# EAGLE design AirU_v2.0_wADC (EAGLE 8.5.0)
COMPANY: ADAFRUIT INDUSTRIES; DRAWN: KTOWN; REV: B

## Sheet 1 of 2
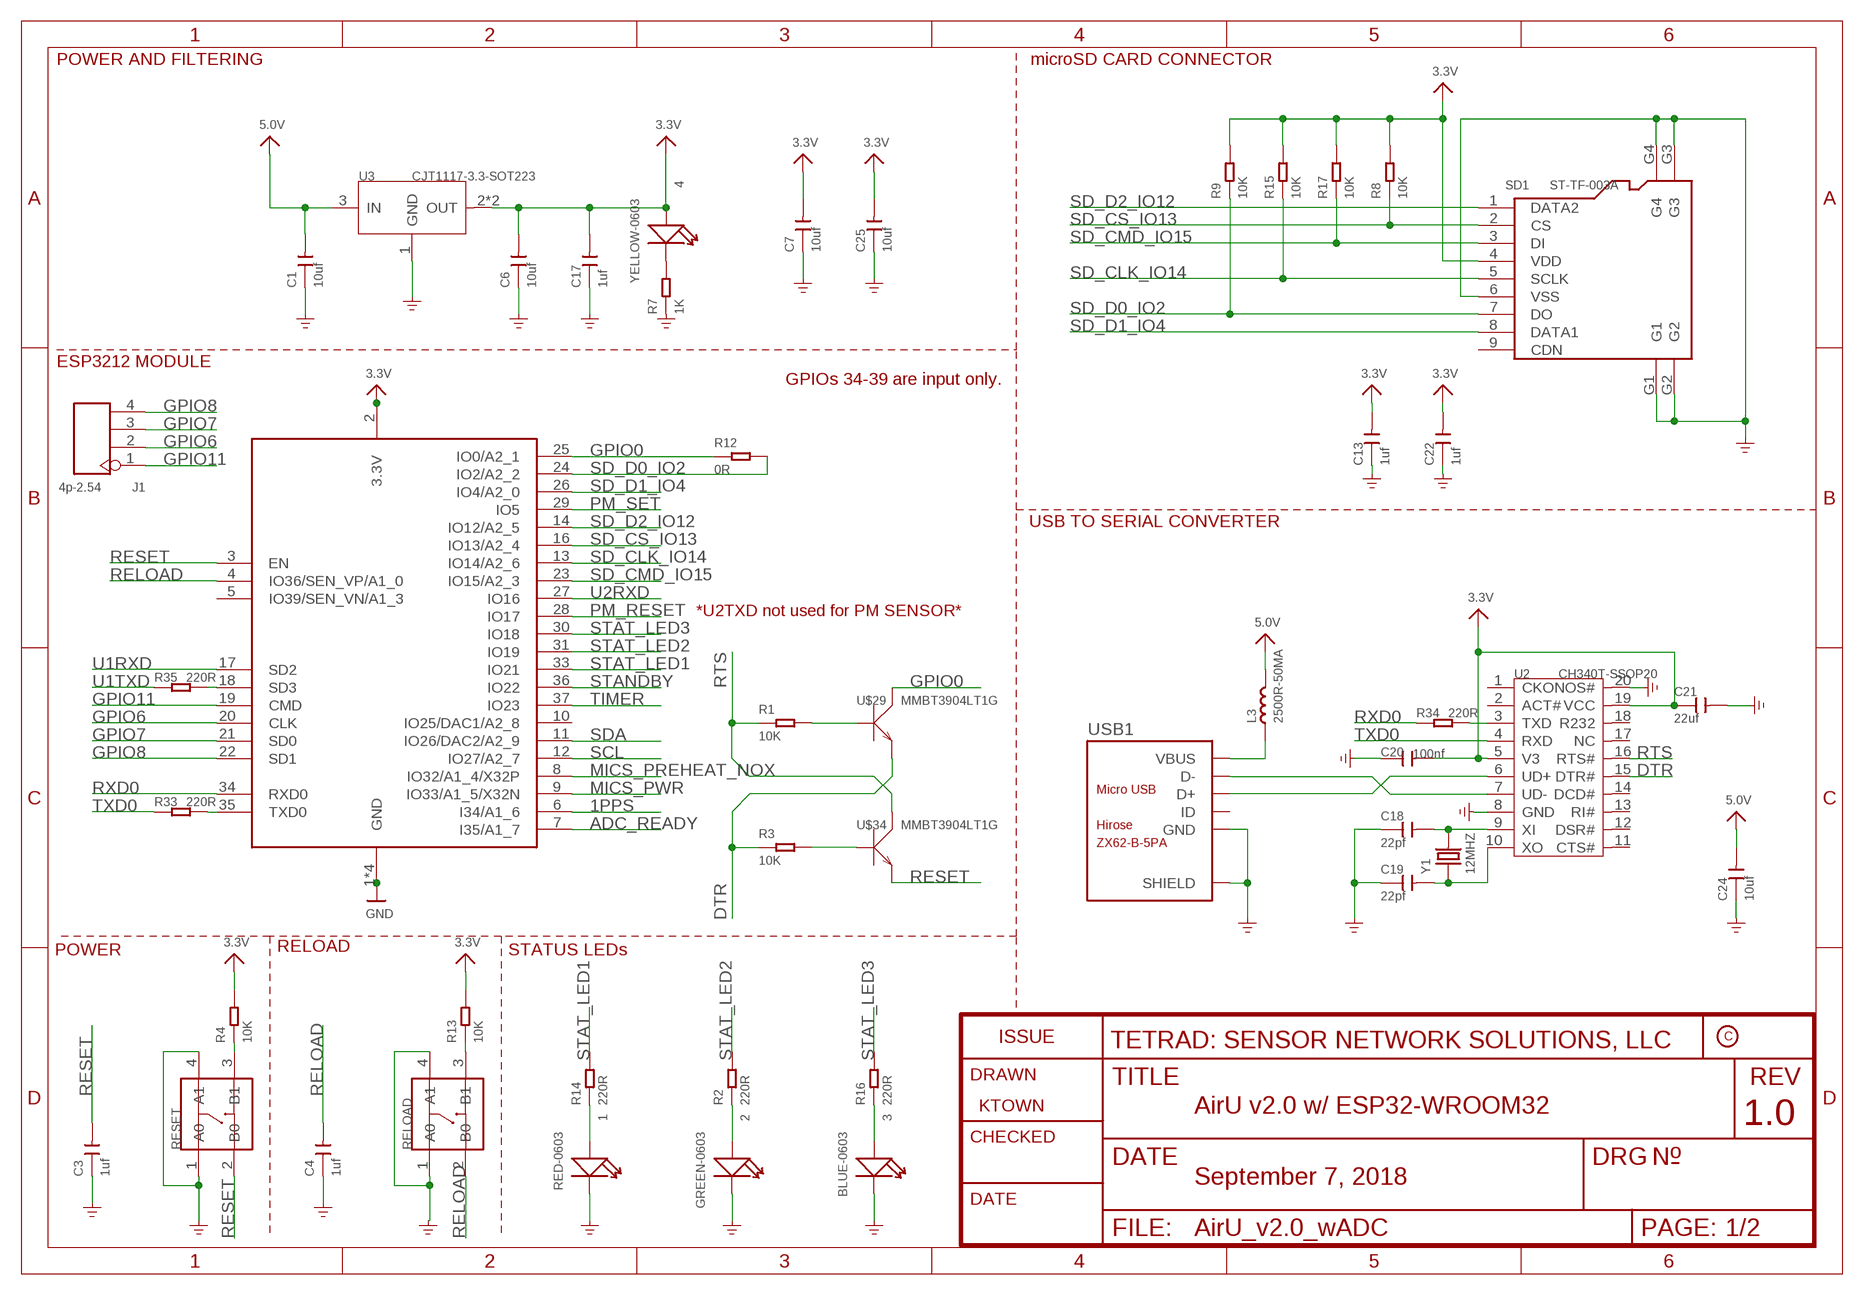
[diagram p0: schematic, sheet 1]
FRAME1 (FRAME_A4): COMPANY: TETRAD: SENSOR NETWORK SOLUTIONS, LLC; REV: 1.0

### Parts
1  RED-0603  LED-SMD-RED-DIFFUSED(0603)  [LED-0603]
2  GREEN-0603  SMD-LED-CLEAR-GREEN(0603)  [LED-0603]
3  BLUE-0603  SMD-LED-CLEAR-BLUE(0603)  [LED-0603]
4  YELLOW-0603  SMD-LED-CLEAR-YELLOW(0603)  [LED-0603]
C1  10uf  CERAMIC-10UF-10V-10%-X5R(0603)  [C0603]
C3  1uf  CERAMIC-1UF-25V-10%-X7R(0603)  [C0603]
C4  1uf  CERAMIC-1UF-25V-10%-X7R(0603)  [C0603]
C6  10uf  CERAMIC-10UF-10V-10%-X5R(0603)  [C0603]
C7  10uf  CERAMIC-10UF-10V-10%-X5R(0603)  [C0603]
C13  1uf  CERAMIC-1UF-25V-10%-X7R(0603)  [C0603]
C17  1uf  CERAMIC-1UF-25V-10%-X7R(0603)  [C0603]
C18  22pf  CERAMIC-22PF-50V-5%-NPO(0603)  [C0603]
C19  22pf  CERAMIC-22PF-50V-5%-NPO(0603)  [C0603]
C20  100nf  CERAMIC-100NF-50V-10%-X7R(0603)  [C0603]
C21  22uf  CERAMIC-22UF-6.3V-20%-X5R(0805)  [C0805]
C22  1uf  CERAMIC-1UF-25V-10%-X7R(0603)  [C0603]
C24  10uf  CERAMIC-10UF-10V-10%-X5R(0603)  [C0603]
C25  10uf  CERAMIC-10UF-10V-10%-X5R(0603)  [C0603]
J1  4p-2.54  DIP-BLACK-MALE-HEADER-VERT(4P-2.54)  [H4-2.54]
L3  2500R-50MA  SMD-FERRITE-BEAD-2500R-50MA(0603)  [L0603]
R1  10K  SMD-RES-10K-1%-1/10W(0603)  [R0603]
R2  220R  SMD-RES-220R-5%-1/10W(0603)  [R0603]
R3  10K  SMD-RES-10K-1%-1/10W(0603)  [R0603]
R4  10K  SMD-RES-10K-1%-1/10W(0603)  [R0603]
R7  1K  SMD-RES-1K-1%-1/10W(0603)  [R0603]
R8  10K  SMD-RES-10K-1%-1/10W(0603)  [R0603]
R9  10K  SMD-RES-10K-1%-1/10W(0603)  [R0603]
R12  0R  SMD-RES-0R-5%-1/10W(0603)  [R0603]
R13  10K  SMD-RES-10K-1%-1/10W(0603)  [R0603]
R14  220R  SMD-RES-220R-5%-1/10W(0603)  [R0603]
R15  10K  SMD-RES-10K-1%-1/10W(0603)  [R0603]
R16  220R  SMD-RES-220R-5%-1/10W(0603)  [R0603]
R17  10K  SMD-RES-10K-1%-1/10W(0603)  [R0603]
R33  220R  SMD-RES-220R-5%-1/10W(0603)  [R0603]
R34  220R  SMD-RES-220R-5%-1/10W(0603)  [R0603]
R35  220R  SMD-RES-220R-5%-1/10W(0603)  [R0603]
RELOAD  DIP-SWITCH-TACTILE-SPST-NO/TS-1109(4P-D6.0MM)'TS-1109'  [SW4-6.0X6.0X5.0MM]
RESET  DIP-SWITCH-TACTILE-SPST-NO/TS-1109(4P-D6.0MM)'TS-1109'  [SW4-6.0X6.0X5.0MM]
SD1  ST-TF-003A  MICRO-SD-CARD-SOCKET-9P(ST-TF-003A)  [MICRO-SD9+4P-SMD-16.1X14.5X1.85MM]
U2  CH340T-SSOP20  INTERFACE-CH340T(SSOP20)  [SSOP20-0.65-7.6X5.2MM]
U3  CJT1117-3.3-SOT223  PMIC-CJT1117-3.3(SOT223)  [SOT-223]
U$29  MMBT3904LT1G  SMD-TRANSISTORS-NPN-40V-200MA-MMBT3904LT1G(SOT-23)  [SOT-23]
U$34  MMBT3904LT1G  SMD-TRANSISTORS-NPN-40V-200MA-MMBT3904LT1G(SOT-23)  [SOT-23]
USB1  ZX62-B-5PA  MICRO-USB-SMD(ZX62-B-5PA)  [MICRO-USB5+6P-SMD-0.65-AB]
X2  ESP32_WROOM32_SKINNY  [WROOM32_SKINNY]
Y1  12MHZ  SMD-CRYSTAL-12MHZ-20PF-20PPM-40R(2P-5.0X3.2MM)  [X2-SMD-5.0X3.2X1.3MM]

### Nets
1PPS: X2.6(I34/A1_6) ; also sheet 2
3.3V: 4.+ C6.2 C7.2 C13.2 C17.2 C20.2 C21.1 C22.2 C25.2 R4.2 R8.2 R9.2 R13.2 R15.2 R17.2 SD1.4(VDD) U2.5(V3) U2.19(VCC) U3.2(OUT) U3.TER(OUT) X2.2(3.3V) ; also sheet 2
5.0V: C1.2 C24.2 L3.2 U3.3(IN) ; also sheet 2
ADC_READY: X2.7(I35/A1_7) ; also sheet 2
DTR: R3.1 U2.15(DTR#) U$29.2(E)
GND: 1.- 2.- 3.- C1.1 C3.1 C4.1 C6.1 C7.1 C13.1 C17.1 C18.1 C19.1 C20.1 C21.2 C22.1 C24.1 C25.1 R7.1 RELOAD.1(A0) RELOAD.4(A1) RESET.1(A0) RESET.4(A1) SD1.6(VSS) SD1.G1 SD1.G2 SD1.G3 SD1.G4 U2.8(GND) U2.20(NOS#) U3.1(GND) USB1.5(GND) USB1.P1(SHIELD) USB1.P2(SHIELD) USB1.P3_1(SHIELD) USB1.P3_2(SHIELD) USB1.P3_3(SHIELD) USB1.P4_1(SHIELD) USB1.P4_2(SHIELD) USB1.P4_3(SHIELD) USB1.P5(SHIELD) USB1.P6(SHIELD) X2.1(GND) X2.15(GND) X2.38(GND) X2.P$1(GND) ; supply symbol labelled GND_POWER ; also sheet 2
GPIO0: R12.1 U$29.3(C) X2.25(IO0/A2_1)
GPIO6: J1.2 X2.20(CLK)
GPIO7: J1.3 X2.21(SD0)
GPIO8: J1.4 X2.22(SD1)
GPIO11: J1.1 X2.19(CMD)
MICS_PREHEAT_NOX: X2.8(IO32/A1_4/X32P) ; also sheet 2
MICS_PWR: X2.9(IO33/A1_5/X32N) ; also sheet 2
N$1: 2.+ R2.1
N$7: 1.+ R14.1
N$12: R3.2 U$34.1(B)
N$13: R1.2 U$29.1(B)
N$22: 3.+ R16.1
N$25: 4.- R7.2
N$26: U2.7(UD-) USB1.2(D-)
N$27: U2.6(UD+) USB1.3(D+)
N$28: C18.2 U2.9(XI) Y1.2
N$29: C19.2 U2.10(XO) Y1.1
N$30: R34.2 U2.3(TXD)
N$31: R35.2 X2.18(SD3)
N$33: R33.2 X2.35(TXD0)
N$37: R13.1 RELOAD.3(B1)
N$38: R4.1 RESET.3(B1)
PM_RESET: X2.28(IO17) ; also sheet 2
PM_SET: X2.29(IO5) ; also sheet 2
RELOAD: C4.2 RELOAD.2(B0) X2.4(IO36/SEN_VP/A1_0)
RESET: C3.2 RESET.2(B0) U$34.2(E) X2.3(EN)
RTS: R1.1 U2.16(RTS#) U$34.3(C)
RXD0: R34.1 X2.34(RXD0)
SCL: X2.12(IO27/A2_7) ; also sheet 2
SD_CLK_IO14: R15.1 SD1.5(SCLK) X2.13(IO14/A2_6)
SD_CMD_IO15: R17.1 SD1.3(DI) X2.23(IO15/A2_3)
SD_CS_IO13: R8.1 SD1.2(CS) X2.16(IO13/A2_4)
SD_D0_IO2: R9.1 R12.2 SD1.7(DO) X2.24(IO2/A2_2)
SD_D1_IO4: SD1.8(DATA1) X2.26(IO4/A2_0)
SD_D2_IO12: SD1.1(DATA2) X2.14(IO12/A2_5)
SDA: X2.11(IO26/DAC2/A2_9) ; also sheet 2
STANDBY: X2.36(IO22) ; also sheet 2
STAT_LED1: R14.2 X2.33(IO21)
STAT_LED2: R2.2 X2.31(IO19)
STAT_LED3: R16.2 X2.30(IO18)
TIMER: X2.37(IO23) ; also sheet 2
TXD0: R33.1 U2.4(RXD)
U1RXD: X2.17(SD2) ; also sheet 2
U1TXD: R35.1 ; also sheet 2
U2RXD: X2.27(IO16) ; also sheet 2
VBUS: L3.1 USB1.1(VBUS)
Unconnected: SD1.9(CDN) U2.1(CKO) U2.2(ACT#) U2.11(CTS#) U2.12(DSR#) U2.13(RI#) U2.14(DCD#) U2.17(NC) U2.18(R232) USB1.4(ID) X2.5(IO39/SEN_VN/A1_3) X2.10(IO25/DAC1/A2_8)

### Notes on the sheet
- POWER AND FILTERING | microSD CARD CONNECTOR
- ESP3212 MODULE
- GPIOs 34-39 are input only.
- USB TO SERIAL CONVERTER
- *U2TXD not used for PM SENSOR*
- POWER | RELOAD | STATUS LEDs
- AirU v2.0 w/ ESP32-WROOM32
- September 7, 2018

## Sheet 2 of 2
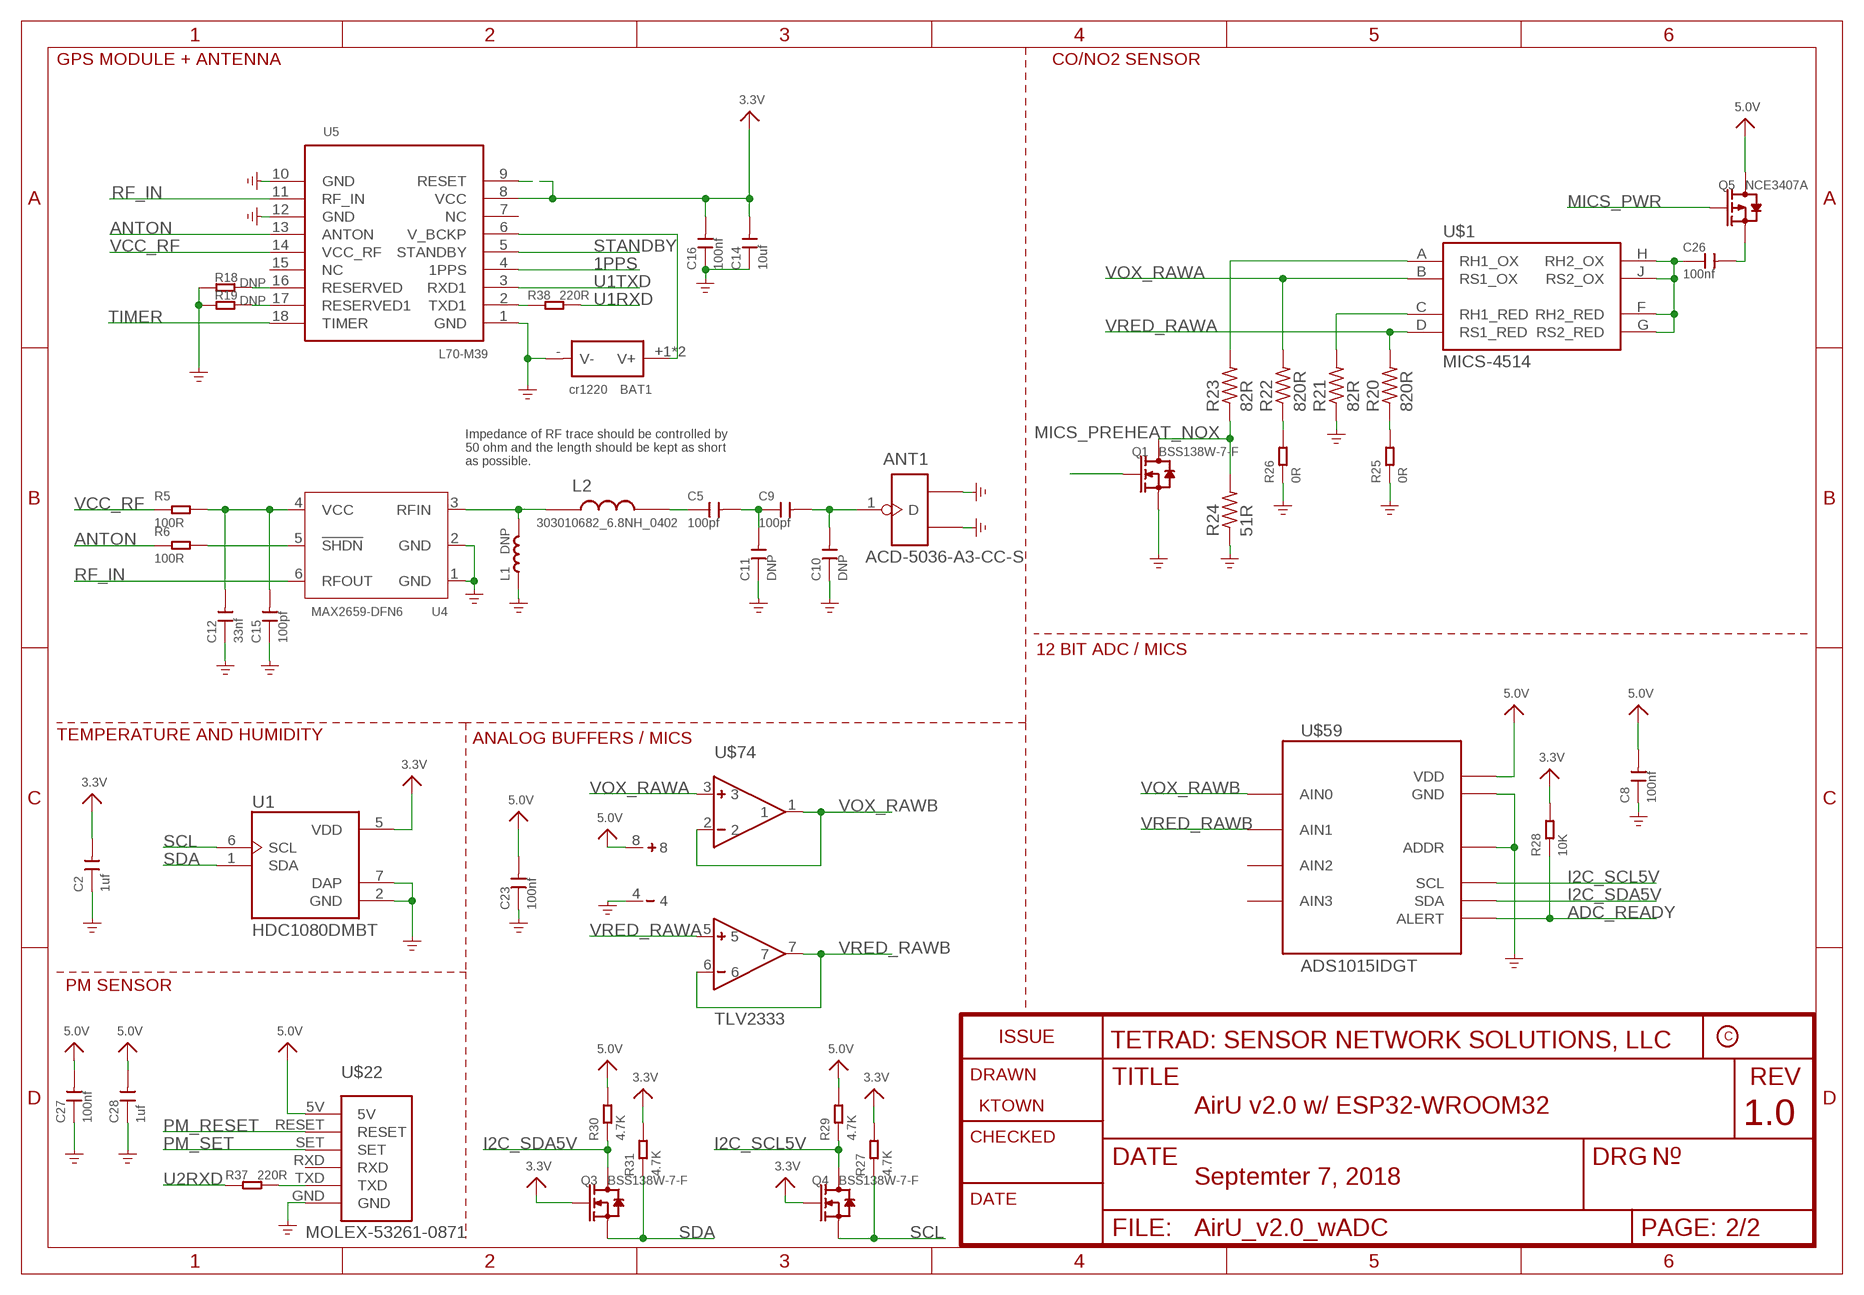
[diagram p1: schematic, sheet 2]
FRAME2 (FRAME_A4): COMPANY: TETRAD: SENSOR NETWORK SOLUTIONS, LLC; REV: 1.0
FRAME3 (FRAME_A4): COMPANY: TETRAD: SENSOR NETWORK SOLUTIONS, LLC; REV: 1.0

### Parts
ANT1  ACD-5036-A3-CC-S  ANTENNA-ACD5036  [ANT3-SMD-5.2X3.7X0.7MM]
BAT1  cr1220  DIP-BATTERY-CELL-HOLDER(1220)  [BAT2P-13.5-CR1220]
C2  1uf  CERAMIC-1UF-25V-10%-X7R(0603)  [C0603]
C5  100pf  CERAMIC-100PF-50V-5%-NPO(0603)  [C0603]
C8  100nf  CERAMIC-100NF-50V-10%-X7R(0603)  [C0603]
C9  100pf  CERAMIC-100PF-50V-5%-NPO(0603)  [C0603]
C10  DNP  CERAMIC-100PF-50V-5%-NPO(0603)  [C0603]
C11  DNP  CERAMIC-100PF-50V-5%-NPO(0603)  [C0603]
C12  33nf  CERAMIC-33NF-50V-10%-X7R(0603)  [C0603]
C14  10uf  CERAMIC-10UF-10V-10%-X5R(0603)  [C0603]
C15  100pf  CERAMIC-100PF-50V-5%-NPO(0603)  [C0603]
C16  100nf  CERAMIC-100NF-50V-10%-X7R(0603)  [C0603]
C23  100nf  CERAMIC-100NF-50V-10%-X7R(0603)  [C0603]
C26  100nf  CERAMIC-100NF-50V-10%-X7R(0603)  [C0603]
C27  100nf  CERAMIC-100NF-50V-10%-X7R(0603)  [C0603]
C28  1uf  CERAMIC-1UF-25V-10%-X7R(0603)  [C0603]
L1  DNP  INDUCTOR/FERRITE-BEAD-0201  [L0201]
L2  303010682_6.8NH_0402  [L0402]
Q1  BSS138W-7-F  SMD-MOSFET-N-CH-50V-200MA-BSS138W-7-F(SOT-23)  [SOT-23]
Q3  BSS138W-7-F  SMD-MOSFET-N-CH-50V-200MA-BSS138W-7-F(SOT-23)  [SOT-23]
Q4  BSS138W-7-F  SMD-MOSFET-N-CH-50V-200MA-BSS138W-7-F(SOT-23)  [SOT-23]
Q5  NCE3407A  SMD-MOSFET-P-CH-VDC=30V-ID=4.3A-NCE3407A(SOT-23)  [SOT-23]
R5  100R  SMD-RES-100R-5%-1/10W(0603)  [R0603]
R6  100R  SMD-RES-100R-5%-1/10W(0603)  [R0603]
R18  DNP  SMD-RES-10K-1%-1/10W(0603)  [R0603]
R19  DNP  SMD-RES-10K-1%-1/10W(0603)  [R0603]
R20  820R  R-US_R0805  [R0805]
R21  82R  R-US_R0603  [R0603]
R22  820R  R-US_R0805  [R0805]
R23  82R  R-US_R0603  [R0603]
R24  51R  R-US_R0603  [R0603]
R25  0R  SMD-RES-0R-5%-1/10W(0603)  [R0603]
R26  0R  SMD-RES-0R-5%-1/10W(0603)  [R0603]
R27  4.7K  SMD-RES-4.7K-5%-1/10W(0603)  [R0603]
R28  10K  SMD-RES-10K-1%-1/10W(0603)  [R0603]
R29  4.7K  SMD-RES-4.7K-5%-1/10W(0603)  [R0603]
R30  4.7K  SMD-RES-4.7K-5%-1/10W(0603)  [R0603]
R31  4.7K  SMD-RES-4.7K-5%-1/10W(0603)  [R0603]
R37  220R  SMD-RES-220R-5%-1/10W(0603)  [R0603]
R38  220R  SMD-RES-220R-5%-1/10W(0603)  [R0603]
U1  HDC1080DMBT  [SON100P300X300X80-7N]
U4  MAX2659-DFN6  AMPLIFIER-MAX2659  [DFN6-0.5-1.5X1.2X0.72MM]
U5  L70-M39  MOUDLE-GPS-L70-HARDWARE  [LGA18-1.1-9.7X10.1X2.5MM]
U$1  MICS-4514  [MICS_10-SMD]
U$22  MOLEX-53261-0871  [MOLEX-53261-0871]
U$59  ADS1015IDGT  [MSOP10_0.5]
U$74  TLV2333  [TLV2333]

### Nets
1PPS: U5.4(1PPS) ; also sheet 1
3.3V: C2.2 C14.2 C16.2 Q3.1(G) Q4.1(G) R27.2 R28.2 R31.2 U1.5(VDD) U5.8(VCC) U5.9(RESET) ; also sheet 1
5.0V: C8.2 C23.2 C27.2 C28.2 Q5.3(D) R29.2 R30.2 U$22.5V U$59.8(VDD) U$74.8 ; also sheet 1
ADC_READY: R28.1 U$59.2(ALERT) ; also sheet 1
ANTON: R6.1 U5.13(ANTON)
GND: ANT1.2(GND1) ANT1.3(GND2) BAT1.-(V-) C2.1 C8.1 C10.1 C11.1 C12.1 C14.1 C15.1 C16.1 C23.1 C27.1 C28.1 L1.1 Q1.2(S) R18.1 R19.1 R21.1 R24.1 R25.1 R26.1 U1.2(GND) U1.7(DAP) U4.1(GND) U4.2(GND) U5.1(GND) U5.10(GND) U5.12(GND) U$22.GND U$59.1(ADDR) U$59.3(GND) U$74.4 ; supply symbol labelled GND_POWER ; also sheet 1
I2C_SCL5V: Q4.3(D) R29.1 U$59.10(SCL)
I2C_SDA5V: Q3.3(D) R30.1 U$59.9(SDA)
MICS_PREHEAT_NOX: Q1.1(G) ; also sheet 1
MICS_PWR: Q5.1(G) ; also sheet 1
N$2: R21.2 U$1.C(RH1_RED)
N$3: C5.2 C9.1 C11.2
N$4: ANT1.1(D) C9.2 C10.2
N$5: L1.2 L2.P$1 U4.3(RFIN)
N$6: R23.2 U$1.A(RH1_OX)
N$8: C5.1 L2.P$2
N$9: R6.2 U4.5(!SHDN)
N$10: C12.2 C15.2 R5.2 U4.4(VCC)
N$11: R18.2 U5.16(RESERVED)
N$14: R19.2 U5.17(RESERVED1)
N$15: BAT1.+1(V+) BAT1.+2(V+) U5.6(V_BCKP)
N$17: R38.1 U5.2(TXD1)
N$18: C26.2 Q5.2(S)
N$23: Q1.3(D) R23.1 R24.2
N$24: C26.1 U$1.F(RH2_RED) U$1.G(RS2_RED) U$1.H(RH2_OX) U$1.J(RS2_OX)
N$32: R22.1 R26.2
N$34: R20.1 R25.2
N$36: R37.2 U$22.TXD
PM_RESET: U$22.RESET ; also sheet 1
PM_SET: U$22.SET ; also sheet 1
RF_IN: U4.6(RFOUT) U5.11(RF_IN)
SCL: Q4.2(S) R27.1 U1.6(SCL) ; also sheet 1
SDA: Q3.2(S) R31.1 U1.1(SDA) ; also sheet 1
STANDBY: U5.5(STANDBY) ; also sheet 1
TIMER: U5.18(TIMER) ; also sheet 1
U1RXD: R38.2 ; also sheet 1
U1TXD: U5.3(RXD1) ; also sheet 1
U2RXD: R37.1 ; also sheet 1
VCC_RF: R5.1 U5.14(VCC_RF)
VOX_RAWA: R22.2 U$1.B(RS1_OX) U$74.3
VOX_RAWB: U$59.4(AIN0) U$74.1 U$74.2
VRED_RAWA: R20.2 U$1.D(RS1_RED) U$74.5
VRED_RAWB: U$59.5(AIN1) U$74.6 U$74.7
Unconnected: U5.7(NC) U5.15(NC) U$22.RXD U$59.6(AIN2) U$59.7(AIN3)

### Notes on the sheet
- GPS MODULE + ANTENNA | CO/NO2 SENSOR
- Impedance of RF trace should be controlled by 
  50 ohm and the length should be kept as short 
  as possible.
- 12 BIT ADC / MICS
- TEMPERATURE AND HUMIDITY | ANALOG BUFFERS / MICS
- PM SENSOR
- AirU v2.0 w/ ESP32-WROOM32
- Septemter 7, 2018

## Library data of the parts
1 = Seeed-LED:LED-SMD-RED-DIFFUSED(0603): 304090042; MPN: 19-217-R6C-AL1M2VY-3T
2 = Seeed-LED:SMD-LED-CLEAR-GREEN(0603): 304090043; MPN: 19-217-G7C-AN1P2-3T
3 = Seeed-LED:SMD-LED-CLEAR-BLUE(0603): 304090045; MPN: 19-217-BHC-ZL1M2RY-3T
4 = Seeed-LED:SMD-LED-CLEAR-YELLOW(0603): 304090044; MPN: 19-217-Y5C-AM1N1VY-3T
ANT1 = Connector-new:ANTENNA-ACD5036; MPN: ACD-5036-A3-CC-S
BAT1 = Seeed-Connector:DIP-BATTERY-CELL-HOLDER(1220): 320170002
C1 C6 C7 C14 C24 C25 = Seeed-Capacitor:CERAMIC-10UF-10V-10%-X5R(0603): 302010103; MPN: CC0603KRX5R6BB106
C2-C4 C13 C17 C22 C28 = Seeed-Capacitor:CERAMIC-1UF-25V-10%-X7R(0603): 302010139; MPN: CC0603KRX7R8BB105
C5 C9 C15 = Seeed-Capacitor:CERAMIC-100PF-50V-5%-NPO(0603): 302010076; MPN: CC0603JRNPO9BN101
C8 C16 C20 C23 C26 C27 = Seeed-Capacitor:CERAMIC-100NF-50V-10%-X7R(0603): 302010138; MPN: CC0603KRX7R9BB104
C10 C11 = Seeed-Capacitor:CERAMIC-100PF-50V-5%-NPO(0603): 302010076; MPN: CC0603JRNPO9BN101; VALUE: 100pf
C12 = Seeed-Capacitor:CERAMIC-33NF-50V-10%-X7R(0603): 302010088; MPN: CC0603KRX7R9BB333
C18 C19 = Seeed-Capacitor:CERAMIC-22PF-50V-5%-NPO(0603): 302010143; MPN: CC0603JRNPO9BN220
C21 = Seeed-Capacitor:CERAMIC-22UF-6.3V-20%-X5R(0805): 302010171; MPN: CC0805MKX5R5BB226
J1 = Seeed-Connector:DIP-BLACK-MALE-HEADER-VERT(4P-2.54): 320020017; MPN: P125-1104A0BS116A1
L1 = Discrete-new:INDUCTOR/FERRITE-BEAD
L2 = Seeed-OPL-2017-01-Inductor-Akita:303010682_6.8NH_0402: Murata;LQW15AN6N8G00D, SMD Inductor 6.8nH-2%-700mA;0402, SKU: 303010682
L3 = Seeed-Inductor:SMD-FERRITE-BEAD-2500R-50MA(0603): 303030020
Q1 Q3 Q4 = Seeed-Transistor:SMD-MOSFET-N-CH-50V-200MA-BSS138W-7-F(SOT-23): 305030000; MPN: BSS138W-7-F
Q5 = Seeed-Transistor:SMD-MOSFET-P-CH-VDC=30V-ID=4.3A-NCE3407A(SOT-23): 305030010; MPN: NCE3407A
R1 R3 R4 R8 R9 R13 R15 R17 R28 = Seeed-Resistor:SMD-RES-10K-1%-1/10W(0603): 301010299; MPN: RC0603FR-0710KL
R2 R14 R16 R33-R35 R37 R38 = Seeed-Resistor:SMD-RES-220R-5%-1/10W(0603): 301010163; MPN: RC0603JR-07220RL
R5 R6 = Seeed-Resistor:SMD-RES-100R-5%-1/10W(0603): 301010090; MPN: RC0603JR-07100RL
R7 = Seeed-Resistor:SMD-RES-1K-1%-1/10W(0603): 301010298; MPN: RC0603FR-071KL
R12 R25 R26 = Seeed-Resistor:SMD-RES-0R-5%-1/10W(0603): 301010292; MPN: RC0603JR-070RL
R18 R19 = Seeed-Resistor:SMD-RES-10K-1%-1/10W(0603): 301010299; MPN: RC0603FR-0710KL; VALUE: 10K
R20-R24 = rcl:R-US_: RESISTOR, American symbol; SPICEPREFIX: R
R27 R29-R31 = Seeed-Resistor:SMD-RES-4.7K-5%-1/10W(0603): 301010290; MPN: RC0603JR-074K7L
RELOAD RESET = Seeed-Switch:DIP-SWITCH-TACTILE-SPST-NO/TS-1109(4P-D6.0MM): 311020024
SD1 = Seeed-Connector:MICRO-SD-CARD-SOCKET-9P(ST-TF-003A): 320090000; MPN: ST-TF-003A
U1 = HDC1080DMBT_TITempHum:HDC1080DMBT: HDC1080 Low Power, High Accuracy Digital Humidity Sensor with Temperature Sensor 6-WSON -40 to 125; DESCRIPTION: HDC1080 Low Power, High Accuracy Digital Humidity Sensor with Temperature Sensor 6-WSON -40 to 125; DIGI-KEY_PART_NUMBER: 296-43864-1-ND; DIGI-KEY_PURCHASE_URL: https://www.digikey.com/product-detail/en/texas-instruments/HDC1080DMBT/296-43864-1-ND/5878615?utm_source=snapeda&utm_medium=aggregator&utm_campaign=symbol; MF: Texas Instruments; MP: HDC1080DMBT; PACKAGE: WDFN-6 Texas Instruments
U2 = Seeed-IC:INTERFACE-CH340T(SSOP20): 310070026; MPN: CH340T
U3 = Seeed-IC:PMIC-CJT1117-3.3(SOT223): 310030097; MPN: CJT1117-3.3
U4 = IC-new:AMPLIFIER-MAX2659: GPS/GNSS Low-Noise Amplifier; MPN: MAX2659
U5 = moudle-new:MOUDLE-GPS-L70-HARDWARE: L70 GPS module; MPN: L70; VALUE: L70
U$1 = MICS-4514:MICS-4514: Metal oxide MEMS carbon monoxide (CO) and NOx sensor in an SMD package.; AVAILABILITY: Unavailable; MF: Amphenol; MP: MICS-4514; PACKAGE: None; PRICE: 11.82 USD
U$22 = Molex_53261_0871_Connector:MOLEX-53261-0871
U$29 U$34 = Seeed-Transistor:SMD-TRANSISTORS-NPN-40V-200MA-MMBT3904LT1G(SOT-23): 305010013; MPN: MMBT3904LT1G
U$59 = ADS1015:ADS1015: Ti ADS1015 12-bit ADC Ultra-Small, Low-Power, 12-Bit Analog-to-Digital Converter with Internal Reference The ADS1013, ADS1014, and ADS1015 are precision analog-to-digital converters (ADCs) with 12 bits of resolution offered in an ultra-small, leadless QFN-10 package or an MSOP-10 package. \ Source: http://focus.ti.com/docs/prod/folders/print/ads1015.html; AVAILABILITY: Unavailable; DESCRIPTION: 12-Bit ADC with Integrated MUX PGA Comparator Oscillator and Reference; MF: Texas Instruments; MP: ADS1015; PACKAGE: XFQFN-10 Texas Instruments; PRICE: None
U$74 = tlv2333:TLV2333
USB1 = Seeed-Connector:MICRO-USB-SMD(ZX62-B-5PA): 320010005; MPN: ZX62-B-5PA
X2 = microbuilder:ESP32_WROOM32
Y1 = Seeed-Crystal Oscillator:SMD-CRYSTAL-12MHZ-20PF-20PPM-40R(2P-5.0X3.2MM): 306010047; MPN: 5032/2P

## Board
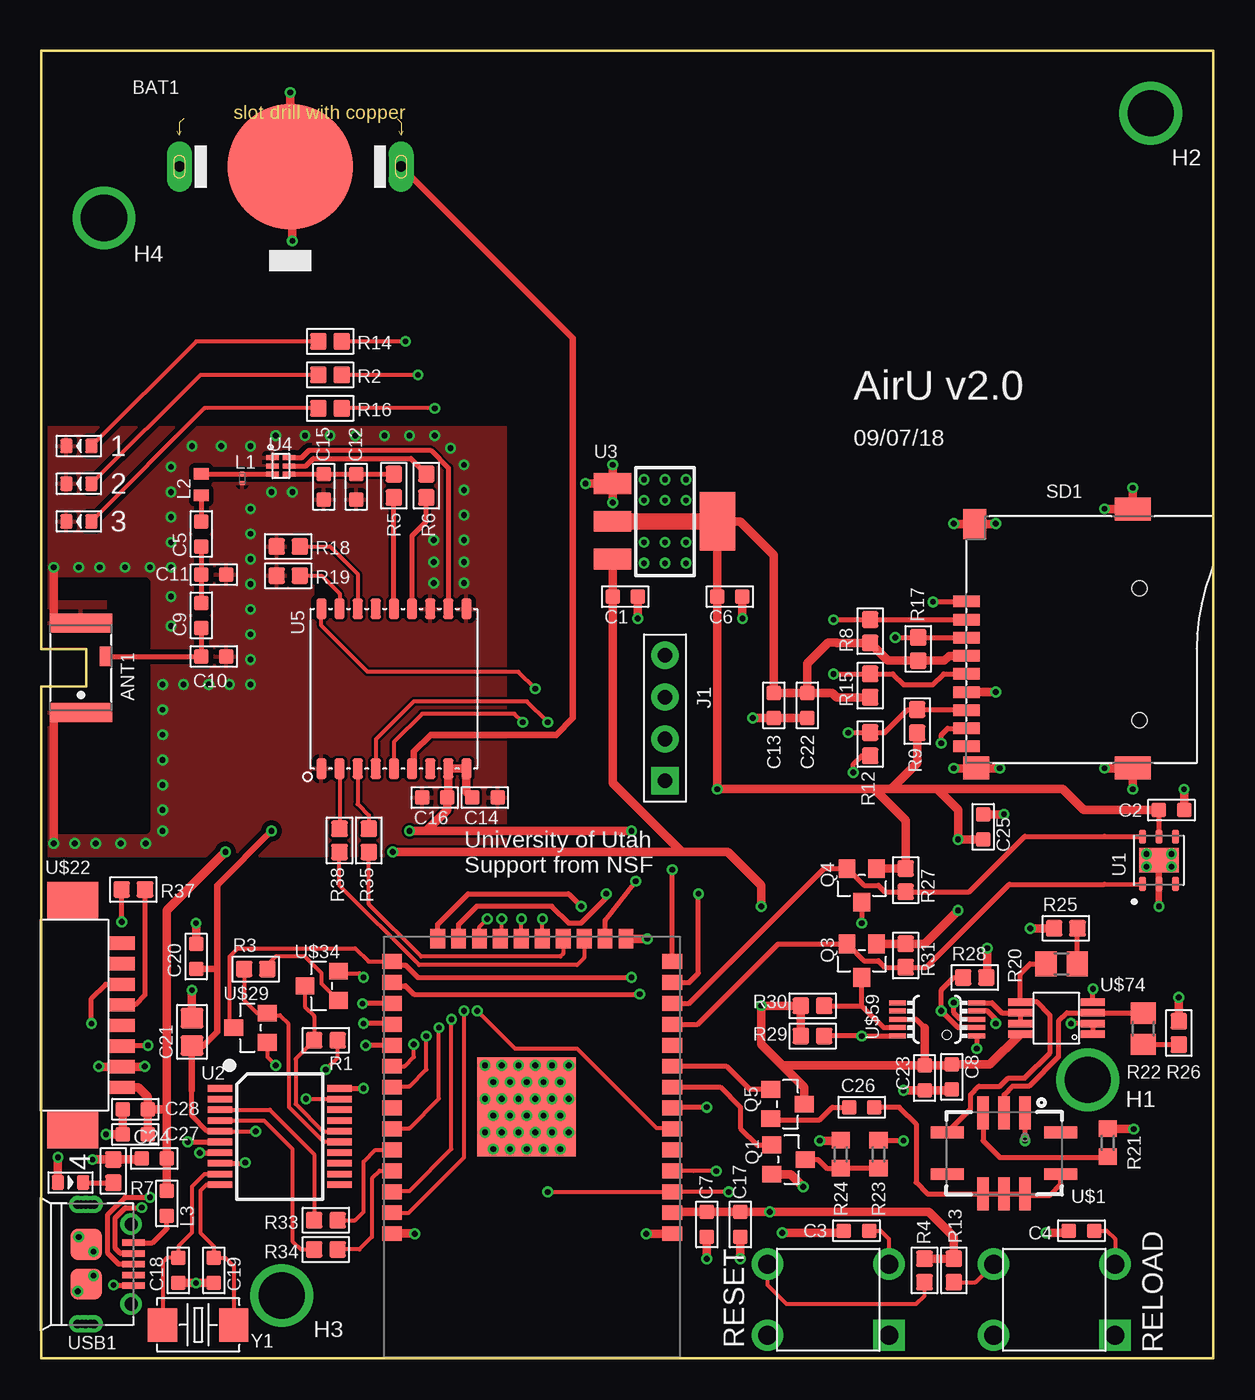
[diagram p2: board, top side]
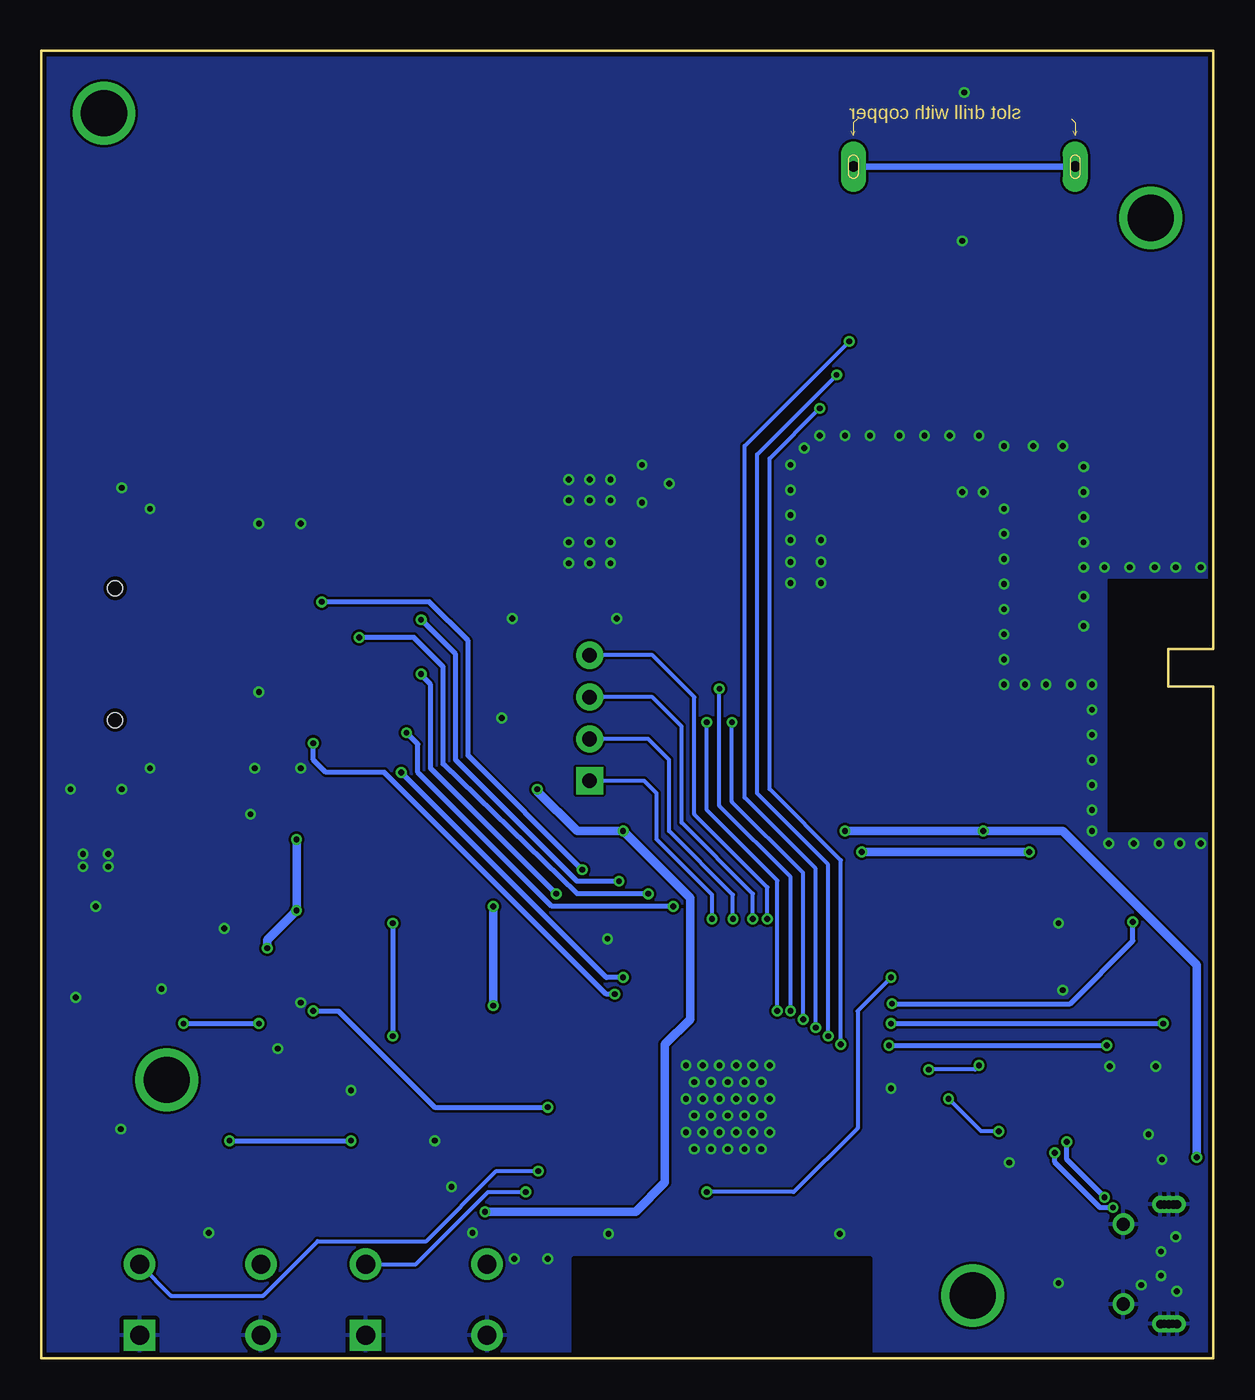
[diagram p3: board, bottom side, seen from below]

Size 71.12 x 79.38 mm. Coordinates in mm from the lower left corner, seen from the top.
Outline: 0,0 71.12,0 71.12,79.38 0,79.38 0,43.05 2.73,43.05 2.73,40.77 0,40.77 0,0
Copper layers (1*16): Top 0.035mm / dielectric 1.5mm / Bottom 0.035mm
Design rules "SeeedStudio_2layer_DRU_no_angle_20140221": minimum track width 6mil, minimum drill 12mil, track to track 6mil, track to pad 6mil, pad to pad 6mil, via to via 6mil, smd to smd 0mil, copper to edge 10mil, drill to drill 10mil, minimum pad ring 10mil, minimum via ring 6mil, stop-mask expansion 2mil, vias tented up to drill 100mil, thermal gap 10mil
tRestrict: area 20.8,0.1 to 38.8,6.1
bRestrict: area 20.8,0.1 to 38.8,6.1; area 0,32.1 to 6.3,47.1; area 0,32 to 6.3,47.2

### Footprints (pad centres in the part's own frame; a part is rotated, then mirrored left to right if it is on the bottom)
LED-0603 = smd 0.762 x 0.889: + -0.762,0; - 0.762,0
ANT3-SMD-5.2X3.7X0.7MM = smd 0.75 x 1.2: 1 1.525,0.7 | smd 3.8 x 1.15: 2 0,2.725; 3 0,-2.725
BAT2P-13.5-CR1220 = drill 0.635 pad 1.524 long: +1 6.731,0; +2 -6.731,0 | smd 7.62 x 7.62: - 0,0
C0603 = smd 0.889 x 0.889: 1 0,0.762; 2 0,-0.762
C0805 = smd 1.397 x 1.27: 1 0,0.835; 2 0,-0.835
H4-2.54 = drill 0.889 pad 1.651 square: 1 0,3.81 | drill 0.889 pad 1.651: 2 0,1.27; 3 0,-1.27; 4 0,-3.81
L0201 = smd 0.279 x 0.318: 1 -0.279,0; 2 0.279,0
L0402 = smd 0.7 x 0.9: P$1 -0.65,0; P$2 0.65,0
L0603 = smd 0.889 x 0.889: 1 -0.762,0; 2 0.762,0
SOT-23 = smd 1.016 x 1.143: 1 -0.889,-1.016; 2 0.889,-1.016; 3 0,1.016
R0603 = smd 1.016 x 1.016: 1 0,0.708; 2 0,-0.708
R0805 = smd 1.3 x 1.5: 1 -0.95,0; 2 0.95,0
R0603' = smd 1 x 1.1: 1 -0.85,0; 2 0.85,0
SW4-6.0X6.0X5.0MM = drill 1.143 pad 1.905 square: 1 -3.683,2.159 | drill 1.143 pad 1.905: 2 -3.683,-2.159; 3 3.683,-2.159; 4 3.683,2.159
MICRO-SD9+4P-SMD-16.1X14.5X1.85MM = smd 1.6 x 0.7: 1 0,2.25; 2 0,1.15; 3 0,0.05; 4 0,-1.05; 5 0,-2.15; 6 0,-3.25; 7 0,-4.35; 8 0,-5.45; 9 0,-6.55 | smd 1.6 x 1.4: G1 0.6,-7.85 | smd 2.2 x 1.4: G2 10.1,-7.85; G3 10.1,7.85 | smd 1.4 x 1.8: G4 0.5,6.95 | hole 0.9: 10.5,-4.95; 10.5,3.05
SON100P300X300X80-7N = smd 0.86 x 0.42: 1 -1.435,1; 2 -1.435,0; 3 -1.435,-1; 4 1.435,-1; 5 1.435,0; 6 1.435,1 | smd 1.5 x 2.4: 7 0,0
SSOP20-0.65-7.6X5.2MM = smd 0.4 x 1.5: 1 -2.925,-3.625; 2 -2.275,-3.625; 3 -1.625,-3.625; 4 -0.975,-3.625; 5 -0.325,-3.625; 6 0.325,-3.625; 7 0.975,-3.625; 8 1.625,-3.625; 9 2.275,-3.625; 10 2.925,-3.625; 11 2.925,3.625; 12 2.275,3.625; 13 1.625,3.625; 14 0.975,3.625; 15 0.325,3.625; 16 -0.325,3.625; 17 -0.975,3.625; 18 -1.625,3.625; 19 -2.275,3.625; 20 -2.925,3.625
SOT-223 = smd 1.27 x 2.286: 1 -2.286,-3.175; 2 0,-3.175; 3 2.286,-3.175 | smd 3.556 x 2.159: TER 0,3.175
DFN6-0.5-1.5X1.2X0.72MM = smd 0.3 x 0.75: 1 -0.5,-0.5; 2 0,-0.5; 3 0.5,-0.5; 4 0.5,0.5; 5 0,0.5; 6 -0.5,0.5
LGA18-1.1-9.7X10.1X2.5MM = smd 1.27 x 0.635: 1 4.85,-4.4; 2 4.85,-3.3; 3 4.85,-2.2; 4 4.85,-1.1; 5 4.85,0; 6 4.85,1.1; 7 4.85,2.2; 8 4.85,3.3; 9 4.85,4.4; 10 -4.85,4.4; 11 -4.85,3.3; 12 -4.85,2.2; 13 -4.85,1.1; 14 -4.85,0; 15 -4.85,-1.1; 16 -4.85,-2.2; 17 -4.85,-3.3; 18 -4.85,-4.4
MICS_10-SMD = smd 0.7 x 2: A 1.27,2.45; B 0,2.45; C -1.27,2.45; F -1.27,-2.45; G 0,-2.45; H 1.27,-2.45 | smd 2 x 0.7: D -3.45,1.27; E -3.45,-1.27; J 3.45,-1.27; K 3.45,1.27
MOLEX-53261-0871 = smd 0.8 x 1.6: 5V 4.375,0.8; GND 3.125,0.8; NC@1 -4.375,0.8; NC@2 -3.125,0.8; RESET -1.875,0.8; RXD 0.625,0.8; SET 1.875,0.8; TXD -0.625,0.8 | smd 2.2 x 3.1: NC@3 -6.975,-2.16; NC@4 6.975,-2.16
MSOP10_0.5 = smd 0.3 x 1.02: 1 -1,-2.4; 2 -0.5,-2.4; 3 0,-2.4; 4 0.5,-2.4; 5 1,-2.4; 6 1,2.4; 7 0.5,2.4; 8 0,2.4; 9 -0.5,2.4; 10 -1,2.4
TLV2333 = smd 1.45 x 0.45: 1 0.725,2.175; 2 0.725,1.525; 3 0.725,0.875; 4 0.725,0.225; 5 5.125,0.225; 6 5.125,0.875; 7 5.125,1.525; 8 5.125,2.175
MICRO-USB5+6P-SMD-0.65-AB = smd 0.4 x 1.35: 1 -1.3,2.875; 2 -0.65,2.875; 3 0,2.875; 4 0.65,2.875; 5 1.3,2.875 | smd 1.9 x 1.9: P1 -1.2,0; P2 1.2,0 | drill 0.508 pad 1.016: P3_1 -3.625,-0.533; P3_2 -3.625,-0.025; P3_3 -3.625,0.483; P4_1 3.625,-0.533; P4_2 3.625,-0.025; P4_3 3.625,0.483 | drill 0.8: P5 -2.425,2.73; P6 2.425,2.73
WROOM32_SKINNY = smd 1.2 x 0.9: 1 -8.5,5; 2 -8.5,3.73; 3 -8.5,2.46; 4 -8.5,1.19; 5 -8.5,-0.08; 6 -8.5,-1.35; 7 -8.5,-2.62; 8 -8.5,-3.89; 9 -8.5,-5.16; 10 -8.5,-6.43; 11 -8.5,-7.7; 12 -8.5,-8.97; 13 -8.5,-10.24; 14 -8.5,-11.51; 25 8.5,-11.51; 26 8.5,-10.24; 27 8.5,-8.97; 28 8.5,-7.7; 29 8.5,-6.43; 30 8.5,-5.16; 31 8.5,-3.89; 32 8.5,-2.62; 33 8.5,-1.35; 34 8.5,-0.08; 35 8.5,1.19; 36 8.5,2.46; 37 8.5,3.73; 38 8.5,5 | smd 0.9 x 1.2: 15 -5.7,-12.9; 16 -4.43,-12.9; 17 -3.16,-12.9; 18 -1.89,-12.9; 19 -0.62,-12.9; 20 0.65,-12.9; 21 1.92,-12.9; 22 3.19,-12.9; 23 4.46,-12.9; 24 5.73,-12.9 | smd 6 x 6: P$1 0.34,-2.7
X2-SMD-5.0X3.2X1.3MM = smd 1.778 x 2.032: 1 -2.159,0; 2 2.159,0

### Placement (x,y rotation side)
1  2.29,55.37 180 top
2  2.29,53.09 180 top
3  2.29,50.8 180 top
4  1.78,10.67 0 top
ANT1  2.41,41.91 0 top
BAT1  15.11,72.33 180 top
C1  35.43,46.23 270 top
C2  68.58,33.27 270 top
C3  49.47,7.75 90 top
C4  63.12,7.75 90 top
C5  9.72,50.04 0 top
C6  41.78,46.23 270 top
C7  40.39,8.13 180 top
C8  55.24,17.08 180 top
C9  9.72,45.09 0 top
C10  10.48,42.61 270 top
C11  10.48,47.56 270 top
C12  19.11,52.9 180 top
C13  44.45,39.62 180 top
C14  26.92,34.04 270 top
C15  17.14,52.9 180 top
C16  23.88,34.04 90 top
C17  42.42,8.13 180 top
C18  8.32,5.33 180 top
C19  10.48,5.33 180 top
C20  9.4,24.38 0 top
C21  9.14,19.81 180 top
C22  46.48,39.62 180 top
C23  53.59,17.02 180 top
C24  6.86,12.13 90 top
C25  57.15,32.26 0 top
C26  49.78,15.24 270 top
C27  5.71,13.59 90 top
C28  5.71,15.11 90 top
J1  37.85,38.86 180 top
L1  12.19,53.4 90 top
L2  9.72,53.02 270 top
L3  7.62,9.4 90 top
Q1  45.34,12.06 270 top
Q3  49.78,24.13 180 top
Q4  49.78,28.7 180 top
Q5  45.28,15.43 270 top
R1  17.27,19.3 90 top
R2  17.53,59.69 90 top
R3  13.02,23.62 90 top
R4  53.59,5.33 180 top
R5  21.4,52.96 180 top
R6  23.37,52.96 180 top
R7  4.38,11.37 0 top
R8  50.29,44.13 0 top
R9  53.15,38.67 0 top
R12  50.29,37.27 180 top
R13  55.37,5.33 180 top
R14  17.53,61.72 90 top
R15  50.29,40.83 0 top
R16  17.53,57.66 90 top
R17  53.21,43.05 0 top
R18  14.99,49.28 90 top
R19  14.99,47.5 90 top
R20  61.91,23.94 180 top
R21  82R  [R0603']  64.71,13.08 270 top
R22  66.87,20 90 top
R23  82R  [R0603']  50.8,12.38 90 top
R24  51R  [R0603']  48.51,12.38 270 top
R25  62.17,26.1 90 top
R26  69.02,19.75 0 top
R27  52.45,29.02 180 top
R28  56.64,23.11 90 top
R29  46.8,19.56 270 top
R30  46.8,21.4 270 top
R31  52.45,24.45 180 top
R33  17.27,6.6 90 top
R34  17.27,8.38 270 top
R35  19.88,31.43 0 top
R37  5.59,28.45 90 top
R38  18.1,31.43 0 top
RELOAD  61.47,3.56 180 top
RESET  47.75,3.56 180 top
SD1  56.13,43.69 0 top
U1  67.82,30.23 90 top
U2  14.48,13.46 270 top
U3  37.85,50.8 270 top
U4  14.54,54.17 270 top
U5  21.4,40.64 270 top
U$1  58.42,12.45 0 top
U$22  4.06,20.83 270 top
U$29  12.7,20.07 90 top
U$34  17.02,22.61 90 top
U$59  54.36,20.57 90 top
U$74  64.52,21.84 180 top
USB1  2.73,5.71 270 top
X2  29.78,12.57 180 top
Y1  9.53,2.03 180 top

### Tracks (layer width: path | path; a pad name or v marks a point on that pad's centre or on a via)
1PPS  (via drill 0.35)
  Top 0.254: X2.6 38.23,13.97 37.34,13.97 32.51,18.8 28.75,18.8 v26.46,21.08 | v30.73,38.61 29.46,39.88 22.61,39.88 20.3,37.57 U5.4
  Bottom 0.254: v26.46,21.08 26.46,29 30.73,33.27 v30.73,38.61
3.3V  (via drill 0.35)
  Top 0.254: U2.5 v13.01,13.79 v13.02,13.78 | v16.07,15.75 U2.19
  Top 0.305: C2.2 U1.5 | U2.5 10.09,13.79 9.14,14.73 9.14,16.26
  Top 0.406: 9.14,16.26 C21.1 9.83,18.98 10.67,19.81 10.67,23.62 | v13.97,32 10.67,28.7 10.67,23.62 | 10.67,23.62 C20.2
  Top 0.508: 4.+ v1.02,12.19 | U5.9 U5.8 24.7,34.1 C16.2 24.64,33.27 23.37,32 | U5.9 25.8,35.45 | 23.37,32 v22.35,32 | U5.9 25.8,34.4 C14.2 | 50.55,29.84 Q4.1 52.44,29.72 R27.2 52.45,32.64 50.55,34.54 | v55.63,27.18 53.59,25.15 52.44,25.15 R31.2 50.68,25.16 Q3.1 | SD1.4 55.08,42.64 54.79,42.34 R17.2 51.37,42.34 R8.2 48.27,43.42 48.26,43.43 47.75,43.43 46.48,42.16 C22.2 | v57.4,24.89 57.4,23.17 R28.2 | 50.55,34.54 51.56,34.54 | 51.56,34.54 54.36,34.54 | 54.36,34.54 61.98,34.54 63.25,33.27 C2.2 | 51.56,34.54 53.15,36.13 R9.2 | 54.36,34.54 55.63,33.27 v55.63,31.5 C25.2 | R4.2 R13.2 55.37,7.37 53.85,8.89 v44.2,8.89 C17.2 C7.2 38.33,8.89 X2.2 | C22.2 C13.2 44.45,48.77 42.42,50.8 U3.TER C6.2 | C22.2 48.01,40.39 48.27,40.12 R15.2 | 23.37,32 v35.81,32 | 41.15,46.1 C6.2 | C6.2 v41.02,34.54 50.55,34.54
  Top 1.016: U3.2 U3.TER
  Bottom 0.254: v13.02,13.78 14.1,13.78 v16.07,15.75
  Bottom 0.508: v22.35,32 v13.97,32 9.14,32 1.02,23.88 v1.02,12.19 | v55.63,31.5 v55.63,27.18 57.4,25.4 v57.4,24.89 | v44.2,8.89 35.05,8.89 33.27,10.67 33.27,19.05 31.75,20.57 31.75,27.94 v35.81,32 38.61,32 41.02,34.42 v41.02,34.54
5.0V  (via drill 0.35)
  Top 0.305: U$59.8 53.09,20.57 53.59,20.07
  Top 0.508: v21.34,30.73 38.86,30.73 | 38.86,30.73 41.66,30.73 43.69,28.7 v43.69,27.43 | 44.96,17.78 43.69,19.05 v43.69,21.4 R30.2 R29.2 | 44.96,17.78 46.29,16.45 Q5.3 | v11.18,30.73 7.62,27.18 7.62,15.11 | 38.86,30.73 34.67,34.92 C1.2 U3.3 | U$74.8 57.57,17.84 C8.2 55.18,17.78 C23.2 | 53.59,20.07 C23.2 | C23.2 44.96,17.78 | 5.02,16.3 U$22.5V 5.9,16.45 6.48,15.88 C28.2 | C28.2 C27.2 | C28.2 7.62,15.11 | L3.2 C24.2 7.62,15.11
  Bottom 0.508: v11.18,30.73 v21.34,30.73 | v43.69,27.43 v43.69,21.4
ADC_READY  (via drill 0.35)
  Top 0.305: U$59.2 55.62,20.07 v54.61,21.08 54.61,22.35 55.37,23.11 R28.1 | v40.39,15.24 38.33,15.24 X2.7
  Bottom 0.305: v54.61,21.08 53.09,21.08 47.24,15.24 v40.39,15.24
ANTON
  Top 0.305: U5.13 22.5,49.93 23.37,50.8 R6.1
DTR
  Top 0.254: R3.1 12.31,21.73 13.08,20.95 U$29.2 13.84,20.83 14.48,20.83 14.99,20.32 14.99,17.27 15.02,17.23 15.02,15.26 16.91,13.38 17.15,13.14 U2.15
GND  (via drill 0.35, 0.51 pad 1.02)
  Top 0.305: U$59.1 56.76,18.8 v56.77,18.8 | U$59.3 55.77,20.57 55.37,20.97 v55.37,21.59 | U$74.4 63.79,22.42 v63.82,22.42 | U2.8 12.38,11.84 v12.38,11.87 | U2.20 v19.56,16.39 v19.56,16.38 | USB1.5 4.41,4.42 v4.38,4.45
  Top 0.406: ANT1.3 2.04,38.81 0.93,38.81 | v67.82,27.43 U1.2 U1.7
  Top 0.508: ANT1.3 2.09,38.86 0.91,38.86 0.76,38.72 0.76,32.01 0.76,32 v0.76,31.24 | ANT1.2 2.41,44.96 0.76,44.96 0.76,46.2 0.76,47.22 v0.76,48.01 | X2.38 22.67,7.57 v22.67,7.56 | X2.1 38.28,7.56 v36.7,7.56 | X2.15 v36.77,25.46 | C17.1 v42.42,6.03 | C7.1 v40.39,6.03 | C3.1 48.7,7.62 v44.96,7.62 | C4.1 62.36,7.62 v60.96,7.62 | R21.1 66.29,13.93 v66.29,13.91 | v46.23,10.41 45.47,11.18 Q1.2 | R24.1 48.51,13.21 v47.24,13.21 | C8.1 55.24,16.26 C23.1 v52.32,16.26 | R26.1 v69.03,21.91 | R25.1 v60.01,26.1 | C2.1 v69.34,34.54 | SD1.G1 56.73,35.81 | 56.73,35.81 v58.17,35.81 | 56.73,35.81 v55.37,35.81 | v55.37,50.67 55.31,50.64 SD1.G4 57.91,50.64 v57.91,50.67 | SD1.6 57.91,40.44 v57.91,40.45 | C22.1 C13.1 v43.18,38.86 | C6.1 v42.55,44.9 | U3.1 v34.67,51.94 | U3.1 v34.67,54.23 | U3.1 v33.02,53.09 | C1.1 v36.2,44.9 | v3.11,12.06 3.11,12.07 R7.1 6.04,12.07 C24.1 | C28.1 C27.1 v3.94,13.59 | v6.29,17.72 6.29,17.7 U$22.GND 3.49,17.7 v3.49,17.72 | v66.23,52.83 SD1.G3 64.52,51.54 v64.52,51.56 | v64.52,35.81 66.23,35.81 SD1.G2 v66.23,34.54 | C25.1 v58.42,33.02 | v15.24,67.82 15.24,72.33 BAT1.- v15.11,76.83 | USB1.P2 3.17,4.51 v3.17,5.02 | USB1.P1 2.29,6.92 v2.29,7.37 | C21.2 v9.14,22.35 | C20.1 v9.4,26.42 | C18.1 v9.4,4.57 C19.1 | X2.P$1 29.46,15.25 v29.46,14.73
  other vias: 39.12,49.53 39.12,48.26 37.85,48.26 37.85,49.53 36.58,49.53 36.58,48.26 36.58,52.07 37.85,52.07 39.12,52.07 39.12,53.34 37.85,53.34 36.58,53.34 29.97,17.78 28.96,17.78 27.94,17.78 26.92,17.78 32,17.78 30.99,17.78 31.5,16.76 30.48,16.76 29.46,16.76 28.45,16.76 27.43,16.76 26.92,15.75 27.94,15.75 28.96,15.75 29.97,15.75 30.99,15.75 32,15.75 31.5,14.73 30.48,14.73 28.45,14.73 27.43,14.73 26.92,13.72 27.94,13.72 28.96,13.72 29.97,13.72 30.99,13.72 32,13.72 31.5,12.7 30.48,12.7 29.46,12.7 28.45,12.7 27.43,12.7 2.48,2.1 2.98,2.1 2.98,9.33 2.41,9.33 8.64,40.89 12.7,55.37 12.7,42.42 7.87,46.23 7.87,51.05 7.87,52.58 7.87,54.1 7.37,40.89 10.16,40.89 11.43,40.89 12.7,40.89 7.87,44.45 7.87,49.53 9.14,55.37 10.92,55.37 12.7,45.47 12.7,43.94 7.87,48.01 14.22,56.01 16,56.01 13.97,52.58 15.24,52.58 12.7,46.99 12.7,48.51 12.7,50.04 12.7,51.56 2.29,48.01 3.56,48.01 5.08,48.01 6.6,48.01 7.37,39.37 7.37,37.85 7.37,36.32 7.37,34.8 7.37,33.27 7.37,32 2.03,31.24 3.3,31.24 4.83,31.24 6.35,31.24 17.53,56.01 19.05,56.01 20.83,56.01 22.35,56.01 23.88,56.01 24.83,55.24 25.65,54.23 25.65,52.7 25.65,51.18 25.65,49.66 25.65,48.32 23.81,49.66 23.81,48.32 23.81,47.05 25.65,47.05 67.06,30.61 68.58,30.61 68.58,29.84 67.06,29.84 2.22,4.06 3.17,6.48
  pour Top (isolate 0.305): 0,30.48 16.51,30.48 16.51,56.52 0,56.52
  pour Bottom: 0,0 71.12,0 71.12,79.38 0,79.38
  pour Top: 16.51,56.52 28.19,56.52 28.19,30.48 16.51,30.48
GPIO0  (via drill 0.35)
  Top 0.254: U$29.3 11.43,20.32 11.43,24.38 11.94,24.89 19.05,24.89 19.86,24.08 X2.25
  Top 0.305: X2.25 21.49,23.88 22.1,23.88 22.86,23.11 v35.81,23.11 | v49.28,35.56 49.28,36.07 49.77,36.57 R12.1
  Bottom 0.305: v35.81,23.11 36.83,23.11 v49.28,35.56
GPIO6  (via drill 0.35)
  Top 0.254: X2.20 29.13,26.66 v29.15,26.67
  Bottom 0.254: v29.15,26.67 29.15,28.13 33.02,32 33.02,36.32 34.29,37.59 J1.2
GPIO7  (via drill 0.35)
  Top 0.254: X2.21 27.94,25.55 v27.94,26.67
  Bottom 0.254: v27.94,26.67 27.94,28.19 32.26,32.51 32.26,38.35 34.04,40.13 J1.3
GPIO8  (via drill 0.35)
  Top 0.254: X2.22 26.59,26.19 v27.07,26.67
  Bottom 0.254: v27.07,26.67 27.07,28.59 31.5,33.02 31.5,40.13 34.04,42.67 J1.4
GPIO11  (via drill 0.35)
  Top 0.254: X2.19 30.4,26.66 v30.42,26.67
  Bottom 0.254: v30.42,26.67 30.42,28.13 33.78,31.5 33.78,34.29 34.54,35.05 J1.1
I2C_SCL5V  (via drill 0.35)
  Top 0.305: Q4.3 v49.78,26.42 | R29.1 v49.78,19.56 49.8,19.57 U$59.10
  Bottom 0.305: v49.78,26.42 v49.78,19.56
I2C_SDA5V
  Top 0.305: R30.1 49.78,21.4 | 49.78,21.4 Q3.3 | 49.78,21.4 51.11,20.07 U$59.9
MICS_PREHEAT_NOX
  Top 0.305: X2.8 41.2,16.46 42.42,15.24 42.42,13.97 43.43,12.95 Q1.1
MICS_PWR
  Top 0.305: Q5.1 42.99,16.32 41.59,17.72 38.3,17.72 X2.9
N$1
  Top 0.254: R2.1 9.65,59.69 2.+
N$2
  Top 0.305: U$1.C 57.15,13.21 58.17,12.19 64.67,12.19 R21.2
N$3
  Top 0.305: C5.2 C11.2 C9.1
N$4
  Top 0.305: C9.2 C10.2 ANT1.1
N$5
  Top 0.305: 9.72,53.68 L2.P$1 L1.2 14.04,53.68 U4.3
N$6  (via drill 0.35)
  Top 0.305: U$1.A v59.69,13.21 | v52.32,13.21 50.83,13.21 R23.2
  Bottom 0.305: v59.69,13.21 v52.32,13.21
N$7
  Top 0.254: R14.1 9.4,61.72 1.+
N$8
  Top 0.305: L2.P$2 C5.1
N$9
  Top 0.305: U4.5 16.07,54.17 16.51,54.61 22.43,54.61 R6.2
N$10
  Top 0.305: U4.4 15.04,53.66 C15.2 C12.2 21.4,53.66 R5.2
N$11
  Top 0.254: R18.2 17.53,49.28 19.2,47.6 U5.16
N$12
  Top 0.254: U$34.1 17.02,22.73 17.02,23.37 16,24.38 14.22,24.38 13.72,23.89 R3.2
N$13  (via drill 0.35)
  Top 0.254: U$29.1 13.72,18.29 v14.22,17.78 | v17.27,17.53 17.98,18.23 R1.2
  Bottom 0.254: v14.22,17.78 14.48,17.53 v17.27,17.53
N$14
  Top 0.254: R19.2 17.02,47.5 18.1,46.42 U5.17
N$15
  Top 0.406: U5.6 22.61,35.9 22.61,36.83 23.62,37.85 31.24,37.85 32.26,38.86 32.26,61.91 BAT1.+2
  Bottom 0.406: BAT1.+2 15.24,72.33 BAT1.+1
N$16  (via drill 2.8)
  other vias: 63.5,16.89
N$17
  Top 0.254: 18.11,35.54 U5.2 R38.1
N$18
  Top 0.305: Q5.2 44.32,14.48 47.24,14.48 48.01,15.24 C26.2
N$19  (via drill 2.8)
  other vias: 14.61,3.81
N$20  (via drill 2.8)
  other vias: 67.31,75.56
N$21  (via drill 2.8)
  other vias: 3.81,69.22
N$22
  Top 0.254: R16.1 9.91,57.66 3.+
N$23
  Top 0.305: R23.1 R24.2 47.65,11.53 47.12,12.06 Q1.3
N$24
  Top 0.305: 61.87,11.07 U$1.J 61.87,10.56 61.21,9.91 59.78,9.91 U$1.H U$1.G U$1.F 53.76,10 53.09,10.67 53.09,14.22 52.07,15.24 C26.1
N$25
  Top 0.305: 4.- R7.2
N$26  (via drill 0.35)
  Top 0.305: USB1.2 4.81,6.37 4.5,6.67 4.5,8.54 5.11,9.14 v6.1,9.14 | U2.7 10.83,12.51 10.8,12.48 v9.62,12.48
  Bottom 0.305: v6.1,9.14 6.87,9.14 9.62,11.9 v9.62,12.48
N$27  (via drill 0.35)
  Top 0.305: USB1.3 4.7,5.71 4.04,6.37 4.04,8.73 5.09,9.78 v6.6,9.78 | v8.89,13.14 10.34,13.14 U2.6
  Bottom 0.305: v8.89,13.14 8.89,12.06 v6.6,9.78
N$28
  Top 0.254: U2.9 9.92,11.19 9.14,10.41 9.14,7.62 8.32,6.79 C18.2 7.62,6.1 7.37,5.84 Y1.2
N$29
  Top 0.254: U2.10 10.03,10.54 9.65,10.16 9.65,7.62 10.48,6.79 C19.2 11.18,6.1 11.68,5.59 Y1.1
N$30
  Top 0.254: U2.3 13.87,15.09 16.56,12.39 R34.2
N$31
  Top 0.254: X2.18 31.67,24.56 31.5,24.38 23.05,24.38 19.88,27.56 R35.2
N$32
  Top 0.305: R22.1 69.01,19.05 R26.2
N$33
  Top 0.254: X2.35 20.53,11.38 20.07,10.92 20.07,7.37 19.3,6.6 R33.2
N$34
  Top 0.305: R20.1 62.86,26.09 R25.2
N$36
  Top 0.305: R37.2 6.3,22.04 5.71,21.45 U$22.TXD
N$37
  Top 0.254: R13.1 56.7,4.63 RELOAD.3
N$38
  Top 0.254: RESET.3 44.07,4.45 45.21,3.3 53.09,3.3 53.59,3.81 R4.1
PM_RESET  (via drill 0.35)
  Top 0.305: X2.28 21.23,20.32 v19.56,20.32 | v3.05,20.32 3.05,21.84 3.91,22.7 U$22.RESET
  Bottom 0.305: v19.56,20.32 v3.05,20.32
PM_SET  (via drill 0.35)
  Top 0.305: X2.29 19.7,19 v19.68,18.99 | v6.48,18.99 6.44,18.95 U$22.SET
  Bottom 0.305: v19.68,18.99 v6.48,18.99
RELOAD  (via drill 0.35)
  Top 0.254: v40.96,11.37 39.57,11.37 X2.4 | C4.2 64.64,7.75 65.15,7.24 RELOAD.2
  Bottom 0.254: RELOAD.2 63.25,3.81 57.66,3.81 54.36,7.11 47.75,7.11 43.5,11.37 v40.96,11.37
RESET  (via drill 0.35)
  Top 0.254: U$34.2 18.16,23.37 19.3,23.37 v19.56,23.11 | v30.73,10.1 38.27,10.1 X2.3 38.3,10.1 v41.72,10.1 | C3.2 50.93,7.75 51.44,7.24 RESET.2
  Bottom 0.254: v19.56,23.11 21.59,21.08 21.59,13.97 25.46,10.1 v30.73,10.1 | RESET.2 48.39,5.71 44.01,10.1 v41.72,10.1
RF_IN
  Top 0.305: U4.6 15.8,54.67 16.26,55.12 23.62,55.12 24.7,54.04 U5.11
RTS
  Top 0.254: U$34.3 16,21.34 16.56,20.77 R1.1 15.43,18.17 15.43,15.43 17.07,13.79 U2.16
RXD0
  Top 0.254: X2.34 20.27,12.65 19.56,11.94 19.56,8.89 19.05,8.38 R34.1
SCL
  Top 0.305: X2.12 39.32,21.54 47.5,29.72 Q4.2 49.91,28.7 50.8,28.7 51.19,28.31 R27.1 56.31,28.31 59.69,31.69 64.51,31.69 U1.6
SD_CLK_IO14  (via drill 0.35)
  Top 0.305: 38.33,22.86 X2.13 39.32,22.81 39.88,23.37 v39.88,28.19 | v48.07,41.53 R15.1 51.68,41.54 52.32,40.89 54.1,40.89 54.75,41.54 SD1.5
  Bottom 0.305: v39.88,28.19 47.5,35.81 47.5,40.89 48.07,41.47 v48.07,41.53
SD_CMD_IO15  (via drill 0.35)
  Top 0.305: X2.23 25.32,26.34 26.42,27.43 30.99,27.43 32,26.42 32.77,26.42 34.29,27.94 v34.29,28.19 | v51.82,43.75 R17.1 56.11,43.76 SD1.3
  Bottom 0.305: v34.29,28.19 38.61,28.19 46.74,36.07 46.74,41.97 48.51,43.75 v51.82,43.75
SD_CS_IO13  (via drill 0.35)
  Top 0.305: X2.16 34.21,26.59 v36.07,28.96 | v48.07,44.83 R8.1 SD1.2
  Bottom 0.305: v36.07,28.96 38.61,28.96 45.97,36.32 45.97,42.74 v48.07,44.83
SD_D0_IO2  (via drill 0.35)
  Top 0.305: X2.24 24.05,26.34 25.91,28.19 32,28.19 v32.77,27.43 | SD1.7 56.1,39.37 R9.1 52.59,39.38 51.19,37.98 R12.2 48.97,37.98 v48.96,37.97
  Bottom 0.305: v32.77,27.43 40.13,27.43 48.26,35.56 48.26,37.27 v48.96,37.97
SD_D1_IO4  (via drill 0.35)
  Top 0.305: X2.26 21.49,22.61 22.1,22.61 22.61,22.1 v36.32,22.1 | 56,38.1 SD1.8 | 56.08,38.29 SD1.8 | v54.61,37.34 54.61,37.85 55,38.24 SD1.8
  Bottom 0.305: v36.32,22.1 36.83,22.1 50.29,35.56 53.85,35.56 54.61,36.32 v54.61,37.34
SD_D2_IO12  (via drill 0.35)
  Top 0.305: 38.35,24.16 X2.14 38.28,28.38 v38.29,29.65 | 56.1,45.97 SD1.1 54.13,45.94 v54.1,45.91
  Bottom 0.305: v38.29,29.65 45.21,36.58 45.21,43.56 47.56,45.91 v54.1,45.91
SDA
  Top 0.305: R31.1 51.19,23.74 50.8,24.13 49.91,24.13 Q3.2 44.7,25.15 39.83,20.27 X2.11 | R31.1 52.59,23.88 | U1.1 64.51,28.77 58.74,28.77 53.71,23.74 R31.1
STANDBY  (via drill 0.35)
  Top 0.254: 21.33,10.16 22.35,10.16 24.89,12.7 v24.89,20.57 | v29.21,38.61 28.7,39.12 23.11,39.12 21.4,37.4 U5.5
  Top 0.305: X2.36 21.33,10.16
  Bottom 0.254: v24.89,20.57 24.89,29.46 29.21,33.78 v29.21,38.61
STAT_LED1  (via drill 0.35)
  Top 0.254: 21.33,13.97 22.35,13.97 24.13,15.75 v24.13,20.07 | v22.1,61.72 R14.2
  Top 0.305: X2.33 21.33,13.97
  Bottom 0.254: v22.1,61.72 28.45,55.37 28.45,34.04 24.13,29.72 v24.13,20.07
STAT_LED2  (via drill 0.35)
  Top 0.254: 21.33,16.51 22.35,16.51 23.37,17.53 v23.37,19.56 | v22.86,59.69 R2.2
  Top 0.305: X2.31 21.33,16.51
  Bottom 0.254: v22.86,59.69 27.69,54.86 27.69,34.29 23.37,29.97 v23.37,19.56
STAT_LED3  (via drill 0.35)
  Top 0.254: X2.30 22.05,17.73 22.61,18.29 v22.61,19.05 | v23.88,57.66 R16.2
  Bottom 0.254: v22.61,19.05 22.61,30.23 26.92,34.54 26.92,54.61 v23.88,57.66
TIMER  (via drill 0.35)
  Top 0.254: X2.37 22.3,8.84 25.65,12.19 v25.65,21.08 | v29.97,40.64 28.96,41.66 19.81,41.66 17,44.47 U5.18
  Bottom 0.254: v25.65,21.08 25.65,26.67 25.65,29.21 29.97,33.53 v29.97,40.64
TXD0
  Top 0.254: U2.4 13.5,14.44 15.24,12.7 15.24,7.11 15.75,6.6 R33.1
U1RXD
  Top 0.254: X2.17 32.94,24.3 32.51,23.88 22.93,23.88 18.1,28.71 R38.2
U1TXD
  Top 0.254: 19.19,35.78 U5.3 19.2,33.63 19.88,32.96 R35.1
U2RXD  (via drill 0.35)
  Top 0.305: X2.27 19.51,21.54 v19.49,21.53 | v4.89,26.48 v4.88,26.49 R37.1
  Bottom 0.305: v19.49,21.53 8.7,21.53 4.89,25.34 v4.89,26.48
VBUS
  Top 0.305: USB1.1 6.76,7.01 7.62,7.87 L3.1
VCC_RF
  Top 0.305: U5.14 R5.1
VOX_RAWA
  Top 0.305: R22.2 66.85,20.97 U$74.3 62.24,20.97 61.72,20.45 61.72,18.29 59.94,16.51 58.93,16.51 58.42,16 U$1.B
VOX_RAWB  (via drill 0.35)
  Top 0.305: U$74.1 U$74.2 v62.48,20.32 | v57.91,20.32 57.91,20.57 57.4,21.08 57.4,21.07 U$59.4
  Bottom 0.305: v62.48,20.32 v57.91,20.32
VRED_RAWA
  Top 0.305: R20.2 60.01,23.94 59.39,23.32 U$74.5 60.42,21.62 61.21,20.83 61.21,18.54 59.69,17.02 58.67,17.02 58.17,16.51 56.9,16.51 56.39,16 56.39,15.13 U$1.D
VRED_RAWB
  Top 0.305: U$74.7 U$74.6 58.28,20.97 57.67,21.57 U$59.5

### Text on the board
tNames: H2 | H4 | AirU v2.0 | 09/07/18 | University of Utah | Support from NSF | H1 | H3